# Altium schematic sheet DSER.SchDoc
size A4
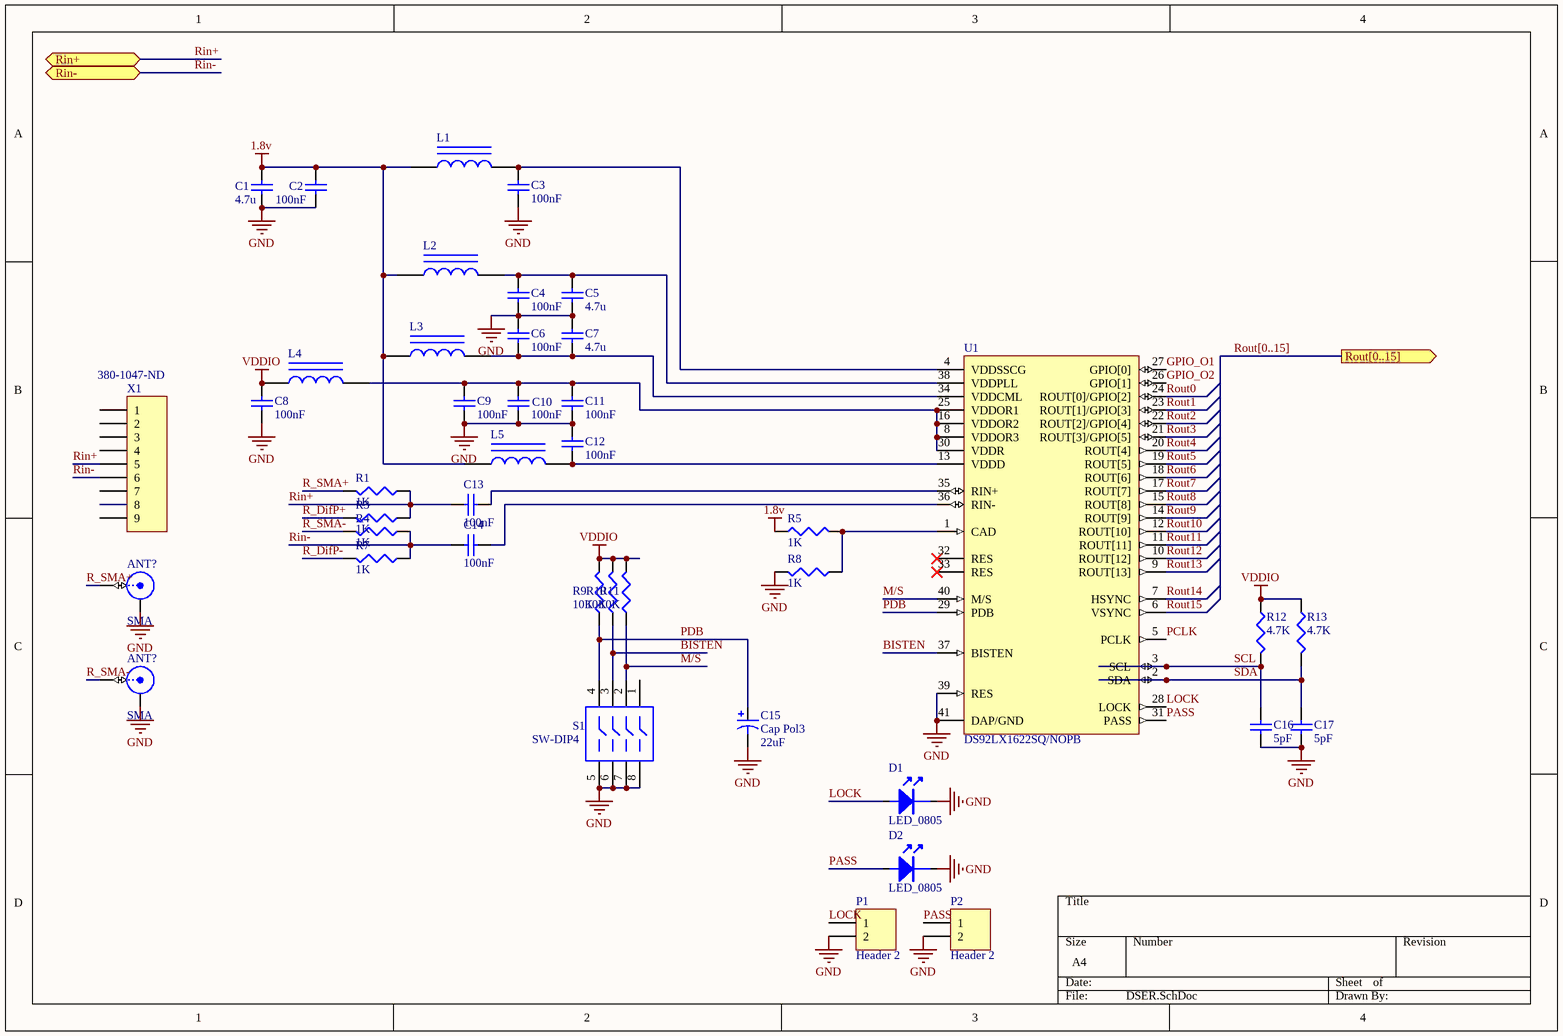
[diagram p0: DSER.SchDoc]

## Parts
(Parts that share a designator on the sheet are numbered #1, #2 ... from top to bottom, then left to right.)
ANT?#1  SMA  [SMB_V-RJ45]
ANT?#2  SMA  [SMB_V-RJ45]
C1  value 4.7u  [1608[0603]]  (hidden comment: Cap Semi)
C2  value 100nF  [1608[0603]]  (hidden comment: Cap Semi)
C3  value 100nF  [1608[0603]]  (hidden comment: Cap Semi)
C4  value 100nF  [1608[0603]]  (hidden comment: Cap Semi)
C5  value 4.7u  [1608[0603]]  (hidden comment: Cap Semi)
C6  value 100nF  [1608[0603]]  (hidden comment: Cap Semi)
C7  value 4.7u  [1608[0603]]  (hidden comment: Cap Semi)
C8  value 100nF  [1608[0603]]  (hidden comment: Cap Semi)
C9  value 100nF  [1608[0603]]  (hidden comment: Cap Semi)
C10  value 100nF  [1608[0603]]  (hidden comment: Cap Semi)
C11  value 100nF  [1608[0603]]  (hidden comment: Cap Semi)
C12  value 100nF  [1608[0603]]  (hidden comment: Cap Semi)
C13  value 100nF  [1608[0603]]  (hidden comment: Cap Semi)
C14  value 100nF  [1608[0603]]  (hidden comment: Cap Semi)
C15  Cap Pol3  value 22uF  [C0805]
C16  value 5pF  [1608[0603]]  (hidden comment: Cap Semi)
C17  value 5pF  [1608[0603]]  (hidden comment: Cap Semi)
D1  LED_0805  [LED0805]
D2  LED_0805  [LED0805]
L1  (no value)  [0805]
L2  (no value)  [0805]
L3  (no value)  [0805]
L4  (no value)  [0805]
L5  (no value)  [0805]
P1  Header 2  [HDR1X2]
P2  Header 2  [HDR1X2]
R1  value 1K  [12Z-2010]  (hidden comment: Res3)
R3  value 1K  [12Z-2010]  (hidden comment: Res3)
R4  value 1K  [12Z-2010]  (hidden comment: Res3)
R5  value 1K  [12Z-2010]  (hidden comment: Res3)
R7  value 1K  [12Z-2010]  (hidden comment: Res3)
R8  value 1K  [12Z-2010]  (hidden comment: Res3)
R9  value 10K  [12Z-2010]  (hidden comment: Res3)
R10  value 10K  [12Z-2010]  (hidden comment: Res3)
R11  value 10K  [12Z-2010]  (hidden comment: Res3)
R12  value 4.7K  [12Z-2010]  (hidden comment: Res3)
R13  value 4.7K  [12Z-2010]  (hidden comment: Res3)
S1  SW-DIP4  [DIP-8]
U1  DS92LX1622SQ/NOPB  [SQA40A]
X1  Supplier Part Number 1: 380-1047-ND  [rj-45]  (hidden comment: SS-7188S-A-NF)

## Ports
Rin+, Rin-, Rout[0..15] (out)

## Nets
1.8v: C1.2 C2.2 L1.2 L2.2 L3.2 L5.2 R5.2
GND: ANT?#1.2(Y) ANT?#2.2(Y) C1.1 C2.1 C3.1 C4.1 C5.1 C6.2 C7.2 C8.1 C9.2 C10.2 C11.2 C12.1 C15.2 C16.1 C17.1 D1.2 D2.2 P1.2 P2.2 R8.1 S1.5 S1.6 S1.7 S1.8 U1.39(RES) U1.41(DAP/GND)
VDDIO: C8.2 L4.2 R9.1 R10.1 R11.1 R12.1 R13.1
BISTEN: R10.2 S1.3 U1.37(BISTEN)
GPIO_O1: U1.27(GPIO[0])
GPIO_O2: U1.26(GPIO[1])
LOCK: D1.1 P1.1 U1.28(LOCK)
M/S: R11.2 S1.2 U1.40(M/S)
PASS: D2.1 P2.1 U1.31(PASS)
PCLK: U1.5(PCLK)
PDB: C15.1 R9.2 S1.4 U1.29(PDB)
R_DifP+: R3.1
R_DifP-: R7.1
R_SMA+: ANT?#1.1(IO) R1.1
R_SMA-: ANT?#2.1(IO) R4.1
Rin+: C13.2 R1.2 R3.2 X1.5 ; port Rin+
Rin-: C14.2 R4.2 R7.2 X1.6 ; port Rin-
Rout0: U1.24(ROUT[0]/GPIO[2])
Rout1: U1.23(ROUT[1]/GPIO[3])
Rout2: U1.22(ROUT[2]/GPIO[4])
Rout3: U1.21(ROUT[3]/GPIO[5])
Rout4: U1.20(ROUT[4])
Rout5: U1.19(ROUT[5])
Rout6: U1.18(ROUT[6])
Rout7: U1.17(ROUT[7])
Rout8: U1.15(ROUT[8])
Rout9: U1.14(ROUT[9])
Rout10: U1.12(ROUT[10])
Rout11: U1.11(ROUT[11])
Rout12: U1.10(ROUT[12])
Rout13: U1.9(ROUT[13])
Rout14: U1.7(HSYNC)
Rout15: U1.6(VSYNC)
SCL: C16.2 R12.2 U1.3(SCL)
SDA: C17.2 R13.2 U1.2(SDA)
NetC3_2: C3.2 L1.1 U1.4(VDDSSCG)
NetC4_2: C4.2 C5.2 L2.1 U1.38(VDDPLL)
NetC6_1: C6.1 C7.1 L3.1 U1.34(VDDCML)
NetC9_1: C9.1 C10.1 C11.1 L4.1 U1.8(VDDOR3) U1.16(VDDOR2) U1.25(VDDOR1) U1.30(VDDR)
NetC12_2: C12.2 L5.1 U1.13(VDDD)
NetC13_1: C13.1 U1.35(RIN+)
NetC14_1: C14.1 U1.36(RIN-)
NetR5_1: R5.1 R8.2 U1.1(CAD)

Not connected (* = marked no-connect by the designer): S1 1; U1 32(RES)* 33(RES)*; X1 1 2 3 4 7 8 9

## Buses and harness runs
bus Rout[0..15] = port Rout[0..15]

## Library data of the parts
ANT?#1 ANT?#2 = SMA-J-P-H-ST-EM1: SMA 50 Ohm Edge Mount; Lager: No; PN RS: *
C1-C14 C16 C17 = Cap Semi: Capacitor (Semiconductor SIM Model); Published: 8-Jun-2000; LatestRevisionDate: 29-May-2009; LatestRevisionNote: IPC-7351 Footprint Added.; PackageReference: C1206; Publisher: Altium Limited; PackageDescription: Chip Capacitor
C15 = Cap Pol3: Polarized Capacitor (Surface Mount); Published: 8-Jun-2000; LatestRevisionDate: 29-May-2009; LatestRevisionNote: IPC-7351 Footprint Added.; PackageReference: C0805; Publisher: Altium Limited; PackageDescription: Chip Capacitor
D1 D2 = LED: Blue
L1-L5 = Inductor Iron: Impedance = 1 kohm (@ 100 MHz)  low DC resistance (<1ohm); Published: 24-Mar-1999; LatestRevisionDate: 17-Jul-2002; LatestRevisionNote: Re-released for DXP Platform.; PackageReference: AXIAL-0.9; Publisher: Altium Limited; PackageDescription: Axial Device, Thru-Hole; 2 Leads; 0.9 in Pin Spacing
P1 P2 = Header 2: Header, 2-Pin; LatestRevisionDate: 17-Jul-2002; LatestRevisionNote: Re-released for DXP Platform.; Publisher: Altium Limited
R1 R3-R5 R7-R13 = Res3: Resistor; Published: 8-Jun-2000; LatestRevisionDate: 29-May-2009; LatestRevisionNote: IPC-7351 Footprint Added.; PackageReference: J1-0603; Publisher: Altium Limited; PackageDescription: Chip Resistor
S1 = SW-DIP4: DIP Switch; Published: 24-Mar-1999; LatestRevisionDate: 17-Jul-2002; LatestRevisionNote: Re-released for DXP Platform.; PackageReference: DIP-8; Publisher: Altium Limited
U1 = DS92LX1622SQ/NOPB: 10 - 50 MHz DC-Balanced Channel Link III Bi-Directional Control Serializer, 40 pin LLP; Manufacturer: National Semiconductor; PackageTopMarking: NS*UZXYTTE#*LX1622; PowerWise: N; CompType: Interface IC; Published: 16-Nov-2010; DatasheetVersion: Sep-2010; PackageVersion: revB, Mar-2004; PackageReference: SQA40A; Publisher: Altium Limited; PackageDescription: LLP, Plastic, Quad, 6 x 6 x 0.8mm Body, 40 Lead, 0.5mm Pitch, No Pullback; PartNumber: DS92LX1622SQ/NOPB; RoHS: Y; PinCount: 40; ComponentLink1Description: DS92LX1622 Datasheet; ComponentLink1URL: http://www.national.com/ds/DS/DS92LX1622.pdf; ComponentLink2Description: DS92LX1622 Web Page; ComponentLink2URL: http://www.national.com/pf/DS/DS92LX1622.html; ComponentLink3Description: SQA40A Package Page; ComponentLink3URL: http://www.national.com/packaging/folders/sqa40a.html
X1 = Header 9: CONN MOD JACK 8P8C R/A SHIELDED; Manufacturer: Stewart Connector; Number of Positions/Contacts: 8p8c (RJ45, Ethernet); Number of Ports: 1; Ratings: Cat5e; LED Color: Does Not Contain LED; Tab Direction: Down; LatestRevisionDate: 17-Jul-2002; LatestRevisionNote: Re-released for DXP Platform.; Publisher: Altium Limited; Supplier 1: Digi-Key; Manufacturer Part Number: SS-7188S-A-NF; RoHS: RoHS Compliant; Category: Connectors, Interconnects; Stock 1: 7949; Pricing 1: 1=1.7, 10=1.546, 25=1.4512, 50=1.3882, 100=1.3251, 250=1.19892, 500=1.10426, 1000=0.9465, 2500=0.8834 (USD); Packaging: Bulk; Part Status: Active; Connector Type: Jack; Number of Rows: 1; Mounting Type: Through Hole; Orientation: 90° Angle (Right); Termination: Solder; Shielding: Shielded; Features: Board Lock; Ingress Protection: -; Contact Material: Copper Alloy; Contact Finish: Gold; Contact Finish Thickness: 30µin (0.76µm); Housing Material: Thermoplastic; Operating Temperature: -40°C ~ 85°C; ComponentLink1URL: https://belfuse.com/resources/StewartConnector/Stewart%20Data%20Sheets/CT710001.pdf; ComponentLink1Description: https://belfuse.com/resources/StewartConnector/Stewart%20Data%20Sheets/CT710001.pdf